# Altium schematic sheet esp32c3supermini.schdoc
size 292 x 205 mm; Device: A_A4; Symbol: A_A4; Name: A_A4; Designator: A; @Project Name: Sheet_3; REV: 1.0; Date: 2026-09-20; Sheet: 1/1; Draw By: sant85082; Company: Your Company; Manufacturer Part: ?; Convert to PCB: yes; Add into BOM: yes; Origin Footprint: NONE; Unique ID: frame_lib_1
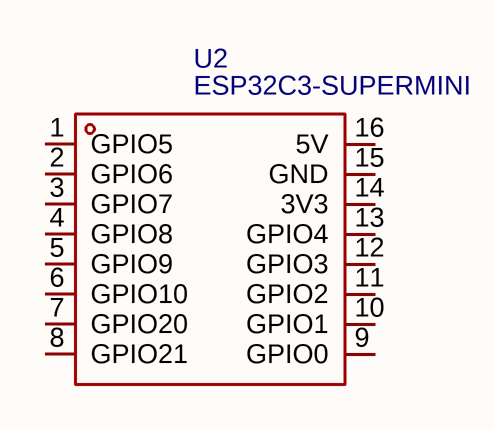
[diagram p0: esp32c3supermini.schdoc]

## Parts
U2  ESP32C3-SUPERMINI  [COMM-SMD_16P-L22.5-W18.0-P2.54-TL]

## Nets

Not connected (* = marked no-connect by the designer): U2 1(GPIO5) 2(GPIO6) 3(GPIO7) 4(GPIO8) 5(GPIO9) 6(GPIO10) 7(GPIO20) 8(GPIO21) 9(GPIO0) 10(GPIO1) 11(GPIO2) 12(GPIO3) 13(GPIO4) 14(3V3) 15(GND) 16(5V)

## Notes on the sheet
- TITLE:
- Sheet_3
- Company:
- Your Company
- Sheet:
- REV:
- 1.0
- 1/1
- Date:
- 2026-09-20
- Drawn By:
- sant85082

## Library data of the parts
U2 = ESP32C3-SuperMini: Manufacturer: null; Convert to PCB: yes; UniqueId: gge8a6b3c8baf90dbf5; Device: ESP32C3-SuperMini; Supplier: LCSC; Supplier Part: C9900147397; Manufacturer Part: ESP32C3-SuperMini; JLCPCB Part Class: Extended Part; Add into BOM: yes; Origin Footprint: COMM-SMD_16P-L22.5-W18.0-P2.54-TL; SymbolName: ESP32C3-SUPERMINI; FootprintName: COMM-SMD_16P-L22.5-W18.0-P2.54-TL